# Altium schematic sheet MPPT_charger.SchDoc
size A4; SheetNumber: 3; SheetTotal: 7
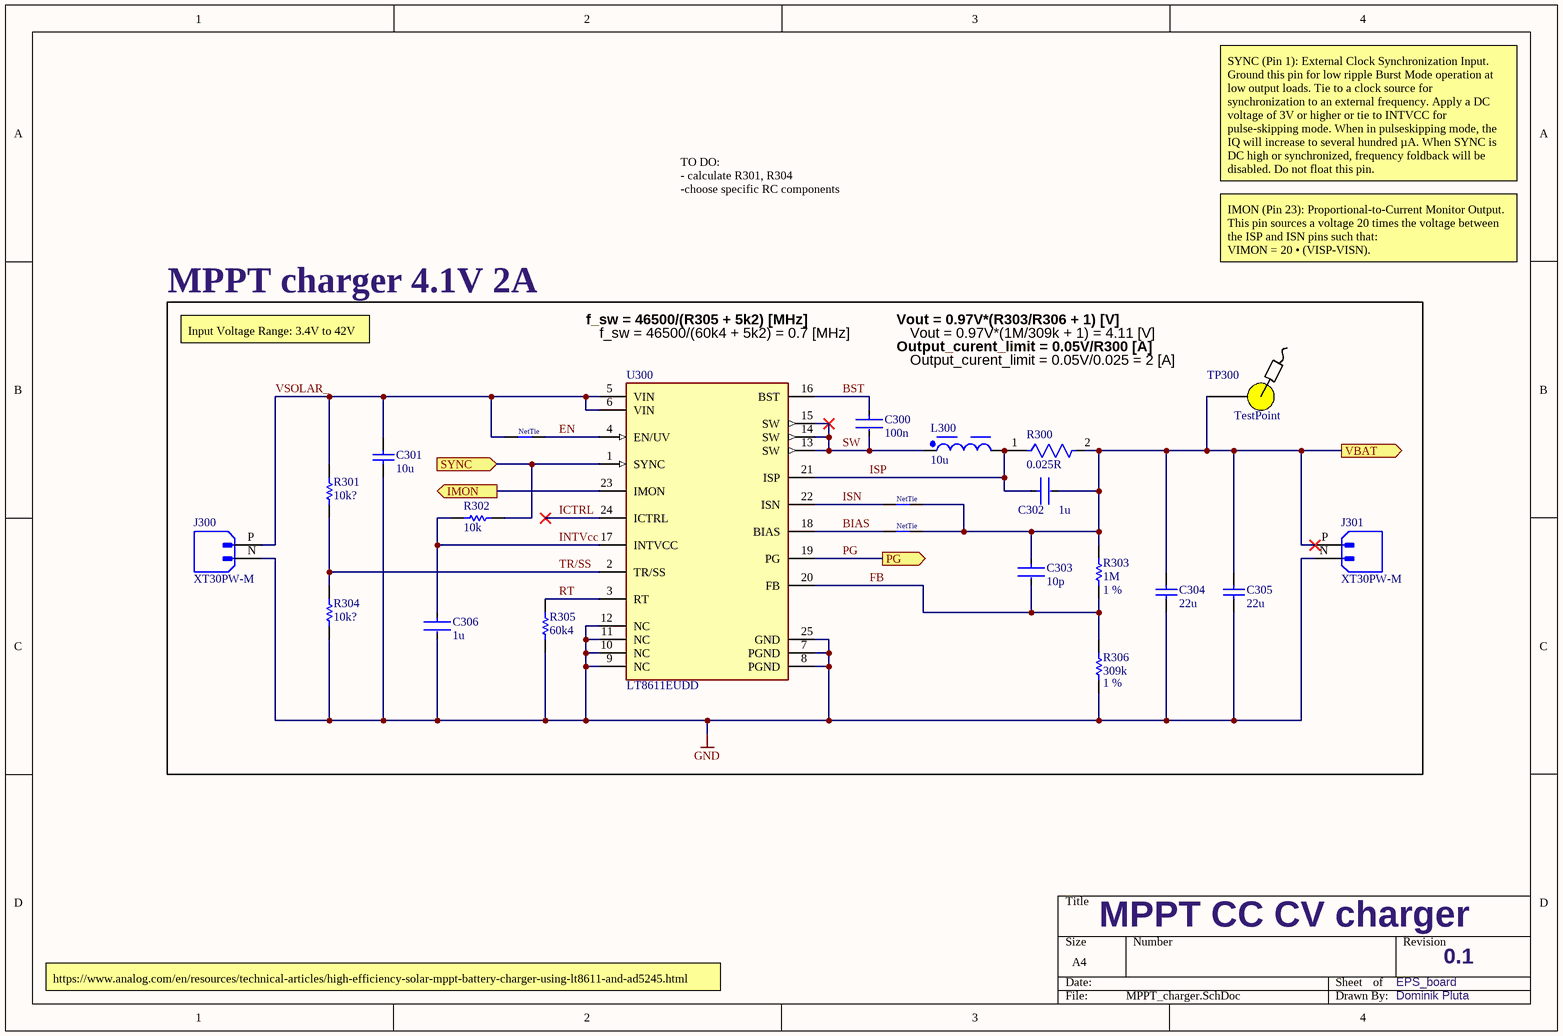
[diagram p0: MPPT_charger.SchDoc]

## Parts
C300  100n  [FP-C0603C-CF-MFG]
C301  10u  [KEMT-1206-2_M]
C302  1u  [FP-C0603C-CF-MFG]
C303  10p  [FP-C0603C-CF-MFG]
C304  22u  [KEMT-1206-2_M]
C305  22u  [KEMT-1206-2_M]
C306  1u  [FP-C0603C-CF-MFG]
J300  XT30PW-M  [AMASS_XT30PW-M]
J301  XT30PW-M  [AMASS_XT30PW-M]
L300  10u  [WE-MAPI_5030]
NT300  NetTie  [NetTie]  (net tie, no BOM)
NT301  NetTie  [NetTie]  (net tie, no BOM)
NT302  NetTie  [NetTie]  (net tie, no BOM)
R300  0.025R  [FP-CR0805-IPC_B]
R301  10k?  [RESC0603(1608)_N]
R302  10k  [RESC0603(1608)_N]
R303  1M  Tolerance: 1 %  [RESC0603(1608)_N]
R304  10k?  [RESC0603(1608)_N]
R305  60k4  [RESC0603(1608)_N]
R306  309k  Tolerance: 1 %  [RESC0603(1608)_N]
TP300  TestPoint  [Test-point]  (no BOM)
U300  LT8611EUDD  [FP-UDD-24-05-08-1833-IPC_B]

## Ports
IMON (out, see EPS[1B]), PG (out, see EPS[1B]), SYNC (in, see EPS[1B]), VBAT (out, see EPS[2B])

## Nets
GND: C301.1 C304.1 C305.1 C306.2 J300.N J301.N R304.1 R305.1 R306.1 U300.7(PGND) U300.8(PGND) U300.9(NC) U300.10(NC) U300.11(NC) U300.12(NC) U300.25(GND)
BIAS: NT302.1 U300.18(BIAS)
BST: C300.1 U300.16(BST)
EN: NT300.2 U300.4(EN/UV)
FB: C303.2 R303.1 R306.2 U300.20(FB)
ICTRL: U300.24(ICTRL)
IMON: U300.23(IMON) ; port IMON
INTVcc: C306.1 R302.2 U300.17(INTVCC)
ISN: NT301.1 U300.22(ISN)
ISP: C302.1 L300.2 R300.1 U300.21(ISP)
PG: U300.19(PG) ; port PG
RT: R305.2 U300.3(RT)
SW: C300.2 L300.1 U300.13(SW) U300.14(SW) U300.15(SW)
SYNC: R302.1 U300.1(SYNC) ; port SYNC
TR/SS: R301.1 R304.2 U300.2(TR/SS)
VBAT: C302.2 C303.1 C304.2 C305.2 J301.P NT301.2 NT302.2 R300.2 R303.2 TP300.1 ; port VBAT
VSOLAR_: C301.2 J300.P NT300.1 R301.2 U300.5(VIN) U300.6(VIN)

## Notes on the sheet
- SYNC (Pin 1): External Clock Synchronization Input. Ground this pin for low ripple Burst Mode operation at low output loads. Tie to a clock source for synchronization to an external frequency. Apply a DC voltage of 3V or higher or tie to INTVCC for pulse-skipping mode. When in pulseskipping mode, the IQ will increase to several hundred µA. When SYNC is DC high or synchronized, frequency foldback will be disabled. Do not float this pin.
- TO DO:
  - calculate R301, R304
  -choose specific RC components
- MPPT charger 4.1V 2A
- IMON (Pin 23): Proportional-to-Current Monitor Output.
  This pin sources a voltage 20 times the voltage between the ISP and ISN pins such that:
  VIMON = 20 • (VISP-VISN).
- Input Voltage Range: 3.4V to 42V
- f_sw = 46500/(R305 + 5k2) [MHz]
- f_sw = 46500/(60k4 + 5k2) = 0.7 [MHz]
- Vout = 0.97V*(R303/R306 + 1) [V]
- Output_curent_limit = 0.05V/R300 [A]
- Vout = 0.97V*(1M/309k + 1) = 4.11 [V]
- Output_curent_limit = 0.05V/0.025 = 2 [A]
- https://www.analog.com/en/resources/technical-articles/high-efficiency-solar-mppt-battery-charger-using-lt8611-and-ad5245.html
- MPPT CC CV charger
- EPS_board
- 0.1
- Dominik Pluta

## Library data of the parts
C300 C302 C303 = CMP-2006-03061-2: CAP CER 50V X7R 0603; Manufacturer: KEMET; Manufacturer Part Number: C0603C104K5RACTU; Tolerance: 0.1; Temperature Coefficient: 30ppm/°C; Material: Ceramic; Automotive Grade: Grade 1; Value: 0.10 μF; Temperature: -55°C to +125°C; RoHS: TRUE; Temperature Range High: +125°C; Lead Free: Yes; Octopart: https://octopart.com/c0603c104k5ractu-kemet-139244; Digikey Description: CAP CER 0.1UF 50V X7R 0603; Category: Cap; Package: C0603C-CF; ComponentLink2Description: Datasheet; Temperature Range Low: -55°C; Device Class L1: Passive Components; Voltage Rating: 50 V; Automotive: Yes; Device Class L3: Ceramic Capacitors; ComponentLink2URL: https://api.kemet.com/component-edge/download/datasheet/C0603C100J5GACAUTO.pdf; Capacitance: 0.10 μF; Device Class L2: Capacitors; Temperature Characteristic: X7R; Height: 0.87mm
C301 C304 C305 = CMP-1037-04202-2: CAP, Ceramic, 0.1 uF, +/- 10%, 50 V, -55 to 125 degC, 1206 (3216 Metric), RoHS, Tape and Reel; Manufacturer: Kemet; Voltage Rating: 50V; Capacitance: 0.1µF; Product Range: KEMET-CSeries; SVHC: ToBeAdvised; Dielectric Characteristic: X7R; Capacitor Case Style: 1206[3216Metric]; Package Reference: 1206-2; Package Description: 2-Leads SMD, Body 3.2 x 1.6 mm; Packaging: Tape&Reel; Operating Temperature Max: 125degC; Capacitance Tolerance: ±10%; Datasheet URL: https://datasheet.ciiva.com/6125/1725438-6125494.pdf; Manufacturer URL: http://www.kemet.com/; Operating Temperature Min: -55degC; Datasheet Version: Jul-13
C306 = CMP-2006-03061-2: CAP CER 50V X7R 0603 / LOW ESR!; Manufacturer: KEMET; Manufacturer Part Number: C0603C104K5RACTU; Tolerance: 0.1; Temperature Coefficient: 30ppm/°C; Material: Ceramic; Automotive Grade: Grade 1; Value: 0.10 μF; Temperature: -55°C to +125°C; RoHS: TRUE; Temperature Range High: +125°C; Lead Free: Yes; Octopart: https://octopart.com/c0603c104k5ractu-kemet-139244; Digikey Description: CAP CER 0.1UF 50V X7R 0603; Category: Cap; Package: C0603C-CF; ComponentLink2Description: Datasheet; Temperature Range Low: -55°C; Device Class L1: Passive Components; Voltage Rating: 50 V; Automotive: Yes; Device Class L3: Ceramic Capacitors; ComponentLink2URL: https://api.kemet.com/component-edge/download/datasheet/C0603C100J5GACAUTO.pdf; Capacitance: 0.10 μF; Device Class L2: Capacitors; Temperature Characteristic: X7R; Height: 0.87mm
J300 J301 = XT30PW-M: Socket; DC supply; XT30; male; PIN: 2; on PCBs; THT; Colour: yellow; MF: AMASS; SnapEDA_Link: https://www.snapeda.com/parts/XT30PW-M/AMASS/view-part/?ref=snap; Package: None; Value: *; MP: XT30PW-M; Check_prices: https://www.snapeda.com/parts/XT30PW-M/AMASS/view-part/?ref=eda
L300 = CMP-03913-130924348-2: 74438367100 Power Inductor, 10Uh, Shielded, 4.8A Rohs Compliant: Yes; Current Rating: 3.3A; Inductance: 10µH; DC Resistance (DCR): 61mΩ; RoHS: Compliant; Ambient Temperature Range Low: -40°C; Min Operating Temperature: -40°C; Ambient Temperature Range High: 85°C; Length: 5.4mm; Max Operating Temperature: 125°C; Height: 3.1mm; NexarPartId: 130924348; Width: 5.4mm
NT300-NT302 = NetTie: Net tie
R300 = CMP-07231-005482-1: Thick Film Chip Resistors 0805 0.025Ω 0.125W 1% 100ppm/°C; Max Power Dissipation: 125mW; Voltage Rating: 150V; Resistance: 1kR; Package Quantity: 1; Contact Plating: Tin; Length: 2mm; Number of Terminations: 2; Max Operating Temperature: 155°C; Depth: 1.25mm; REACH SVHC: No SVHC; Case Code (Imperial): 0805; Termination: SMD/SMT; Min Operating Temperature: -55°C; Case Code (Metric): 2012; Width: 1.25mm; Packaging: Tape and Reel; Case/Package: 0805; Height: 0.5mm; Radiation Hardening: No; Thickness: 508um; Temperature Coefficient: 100ppm/°C; Mount: Surface Mount; Features: Moisture Resistant; Voltage Rating (DC): 150V; Composition: Thick Film; Power Rating: 125mW; Number of Pins: 2; Tolerance: 1%
R301 R304 R305 = CMP-1012-00081-1: 2K 0.1W 5% 0603 (1608 Metric)  SMD; Case-Metric: 1608; Value: 2000.00 Ohm; Case-EIA: 0603; Tolerance: 5 %; Technology: SMT; Power: 0.1 W
R302 = CMP-1012-00081-1: 10K 0.1W 5% 0603 (1608 Metric)  SMD; Case-Metric: 1608; Value: 2000.00 Ohm; Case-EIA: 0603; Tolerance: 5 %; Technology: SMT; Power: 0.1 W
R303 = CMP-1012-00081-1: 1M 0.1W 1% 0603 SMD; Case-Metric: 1608; Value: 1000000.00 Ohm; Case-EIA: 0603; Technology: SMT; Power: 0.1 W
R306 = CMP-1012-00081-1: 309k 0.1W 1% 0603 SMD; Case-Metric: 1608; Value: 309000.00 Ohm; Case-EIA: 0603; Technology: SMT; Power: 0.1 W
TP300 = Test-point: SMD test point
U300 = CMP-0491-02169-2: IC REG BUCK ADJ 2.5A 24QFN; Synchronous Rectifier: Yes; Number of Outputs: 1; Output Type: Adjustable; Switching Frequency: 2MHz; Efficiency: 96%; Output Voltage: 40V; Max Operating Temperature: 125°C; Output Current: 2.5A; RoHS Compliant: Yes; Case/Package: QFN; Package Quantity: 2500; Lead Free: Lead Free; Series: -; Number of Pins: 24; Min Operating Temperature: -40°C; Packaging: Tape and Reel